# Altium project GameController.PrjPcb
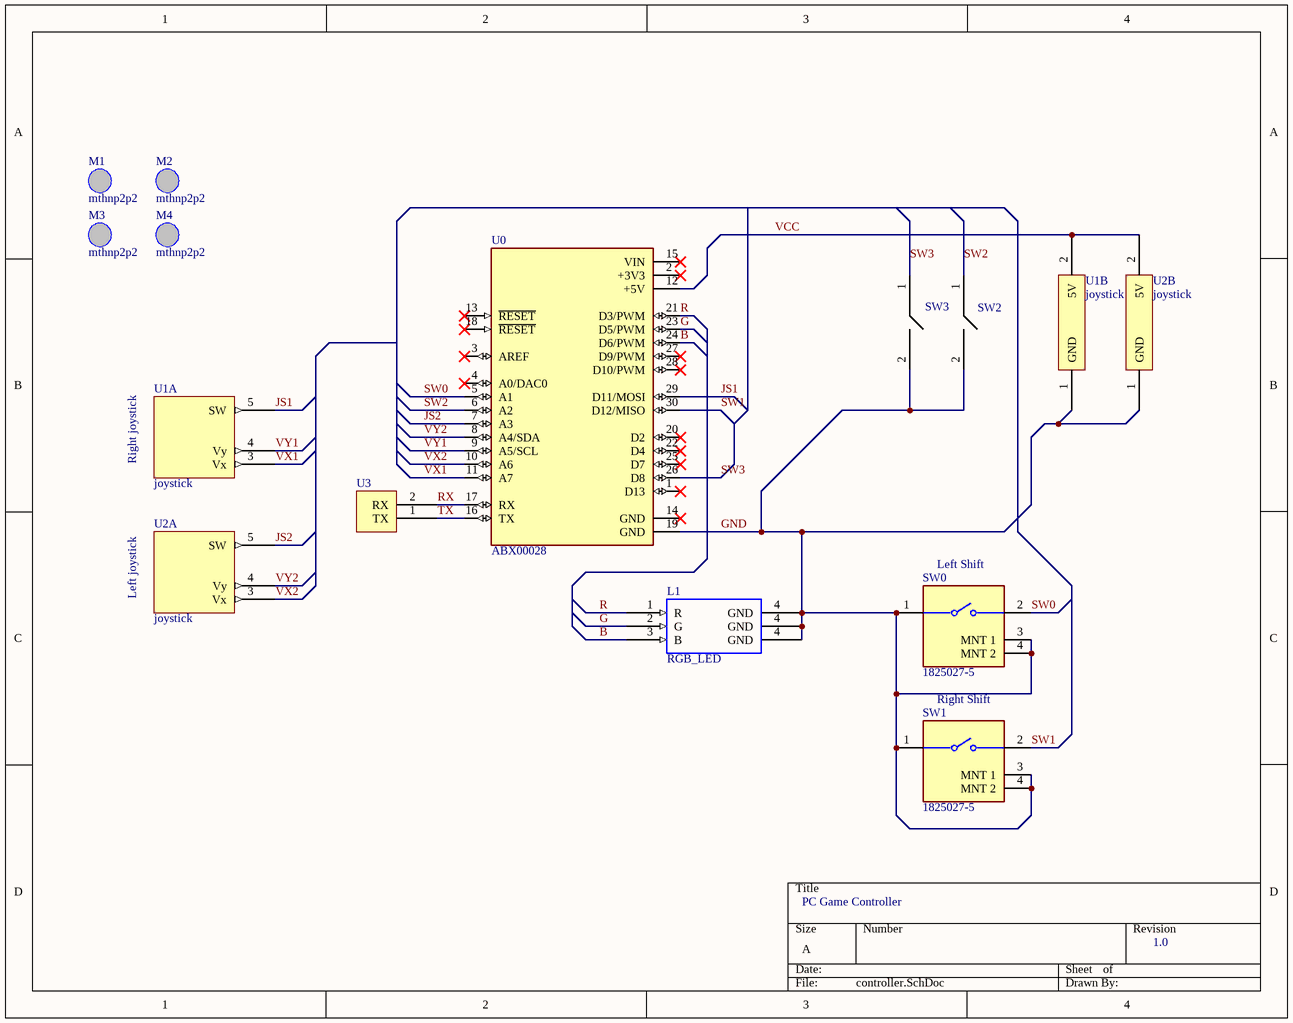
[diagram p0: controller.SchDoc]
1 sheet, 13 parts. Net scope: global (net labels, ports and power ports of the same name join across sheets).
Board file: controller.PcbDoc

## Sheet controller.SchDoc
size A; SheetNumber: 1; SheetTotal: 1

### Parts
L1  RGB_LED  [RGB_LED]
M1  mthnp2p2  [mthnp2p2]
M2  mthnp2p2  [mthnp2p2]
M3  mthnp2p2  [mthnp2p2]
M4  mthnp2p2  [mthnp2p2]
SW0  1825027-5  [FP-1825027-5-0]
SW1  1825027-5  [FP-1825027-5-0]
SW2  (no value)  [DIP_BUTTON]
SW3  (no value)  [DIP_BUTTON]
U0  ABX00028  [MODULE_ABX00028]
U1  joystick  [joystick]  (parts A,B of 2)
U2  joystick  [joystick]  (parts A,B of 2)
U3  (no value)  [PCBComponent_1]

### Nets
B: L1.3(B) U0.24(D6/PWM)
G: L1.2(G) U0.23(D5/PWM)
GND: L1.4(GND) SW0.1 SW0.3(MNT_1) SW0.4(MNT_2) SW1.1 SW1.3(MNT_1) SW1.4(MNT_2) SW2.2 SW3.2 U0.19(GND) U1.1(GND) U2.1(GND)
JS1: U0.29(D11/MOSI) U1.5(SW)
JS2: U0.7(A3) U2.5(SW)
R: L1.1(R) U0.21(D3/PWM)
RX: U0.17(RX) U3.2(RX)
SW0: SW0.2 U0.5(A1)
SW1: SW1.2 U0.30(D12/MISO)
SW2: SW2.1 U0.6(A2)
SW3: SW3.1 U0.26(D8)
TX: U0.16(TX) U3.1(TX)
VCC: U0.12(+5V) U1.2(5V) U2.2(5V)
VX1: U0.11(A7) U1.3(Vx)
VX2: U0.10(A6) U2.3(Vx)
VY1: U0.9(A5/SCL) U1.4(Vy)
VY2: U0.8(A4/SDA) U2.4(Vy)

Not connected (* = marked no-connect by the designer): U0 1(D13)* 2(+3V3)* 3(AREF)* 4(A0/DAC0)* 13(~{RESET})* 14(GND)* 15(VIN)* 18(~{RESET})* 20(D2)* 22(D4)* 25(D7)* 27(D9/PWM)* 28(D10/PWM)*

### Notes on the sheet
- Right joystick
- (near SW0) Left Shift
- Left joystick
- Right Shift
- PC Game Controller
- 1.0

### Library data of the parts
SW0 SW1 = CMP-2000-05514-2: SWITCH TACTILE SPST-NO 0.05A 24V; Manufacturer: TE Connectivity; Contact Current Rating: 50mA; Contact Resistance: 100mΩ; Electromechanical Life: 100000Cycles; Operating Force: 160gf; Throw Configuration: SPST-NO; Lead Free: Yes; Digikey Description: SWITCH TACTILE SPST-NO 0.05A 24V; ComponentLink2Description: Datasheet; Height: 7.31mm; ComponentLink2URL: https://www.te.com/commerce/DocumentDelivery/DDEController?Action=showdoc&DocId=Customer+Drawing%7F1825027%7FG4%7Fpdf%7FEnglish%7FENG_CD_1825027_G4.pdf%7F1825027-5; Mount: Through Hole; Temperature Range High: +85°C; Temperature: -35°C to +85°C; RoHS: TRUE; Device Class L3: Pushbutton Switches; Package: 1825027-5; Temperature Range Low: -35°C; Category: Switch; Automotive: No; Octopart: https://octopart.com/1825027-5-te+connectivity-46510878; Mouser Description: Tactile Switches R/A TACT 160G PB SWITCH; Manufacturer Part Number: 1825027-5; Voltage Rating Dc: 24V; Device Class L2: Switches; Device Class L1: Electromechanical
SW2 SW3 = button
U0 = ABX00028: Arduinoâ€™s 5V compatible board in the smallest available form factor: 45x18mm!; MP: Arduino Nano Every; Check_prices: https://www.snapeda.com/parts/Arduino%20Nano%20Every/Arduino/view-part/?ref=eda; Value: *; Availability: Not in stock; Price: None; Package: None; SnapEDA_Link: https://www.snapeda.com/parts/Arduino%20Nano%20Every/Arduino/view-part/?ref=snap; MF: Arduino
U3 = U*